# Altium schematic sheet single-phase_bridge_over.SchDoc
size A3
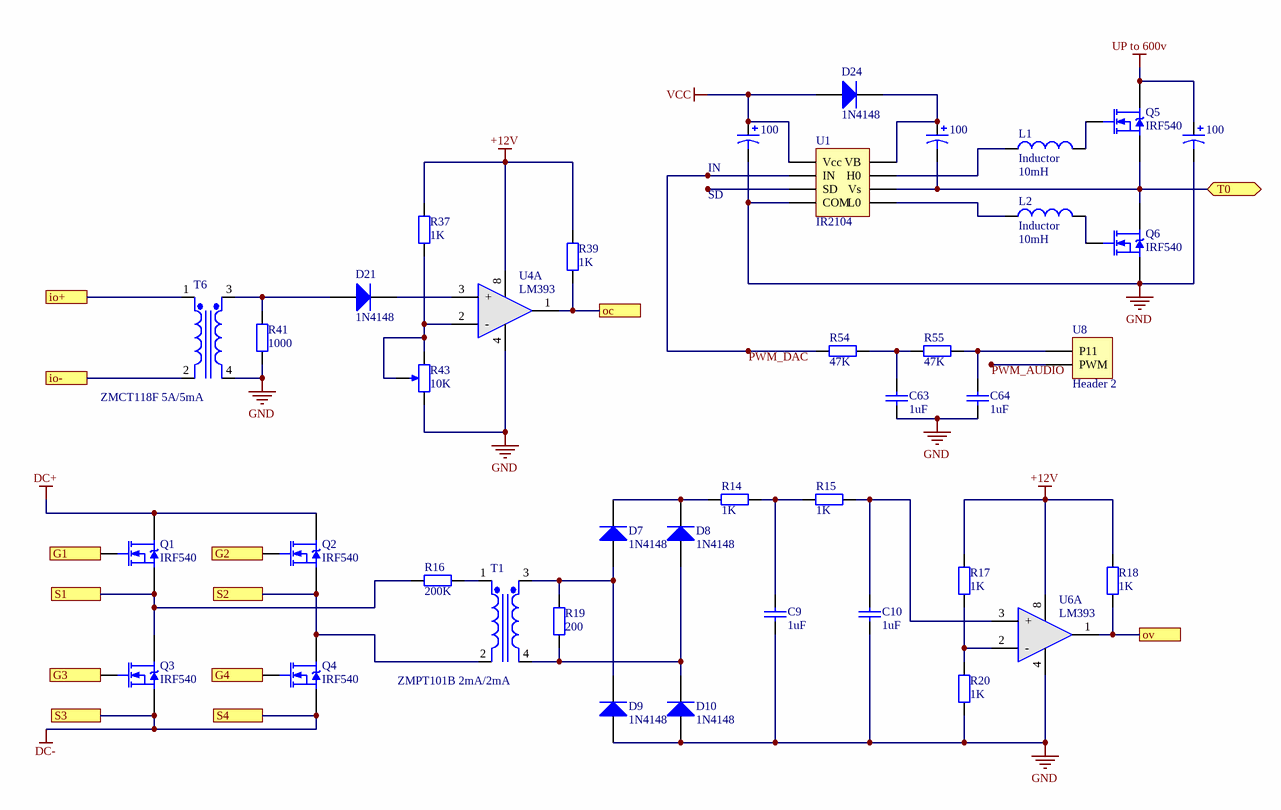
[diagram p0: single-phase_bridge_over.SchDoc]

## Parts
(Parts that share a designator on the sheet are numbered #1, #2 ... from top to bottom, then left to right.)
100#1  (no value)  [C0805]
100#2  (no value)  [C0805]
100#3  (no value)  [C0805]
C9  value 1uF  [0805C]  (hidden comment: Cap)
C10  value 1uF  [0805C]  (hidden comment: Cap)
C63  value 1uF  [0805C]  (hidden comment: Cap)
C64  value 1uF  [0805C]  (hidden comment: Cap)
D7  Type: 1N4148  [DIODE-SMA]  (hidden comment: Diode)
D8  Type: 1N4148  [DIODE-SMA]  (hidden comment: Diode)
D9  Type: 1N4148  [DIODE-SMA]  (hidden comment: Diode)
D10  Type: 1N4148  [DIODE-SMA]  (hidden comment: Diode)
D21  Type: 1N4148  [DIODE-SMA]  (hidden comment: Diode)
D24  Type: 1N4148  [DIODE-SMA]  (hidden comment: Diode)
L1  Inductor  value 10mH  [0402-A]
L2  Inductor  value 10mH  [0402-A]
Q1  IRF540  [TO-220]
Q2  IRF540  [TO-220]
Q3  IRF540  [TO-220]
Q4  IRF540  [TO-220]
Q5  IRF540  [TO-220]
Q6  IRF540  [TO-220]
R14  value 1K  [0805R]  (hidden comment: Res2)
R15  value 1K  [0805R]  (hidden comment: Res2)
R16  value 200K  [0805R]  (hidden comment: Res2)
R17  1K  [0805R]
R18  1K  [0805R]
R19  value 200  [0805R]  (hidden comment: Res2)
R20  1K  [0805R]
R37  1K  [0805R]
R39  1K  [0805R]
R41  value 1000  [0805R]  (hidden comment: Res2)
R43  10K  [RPot_3296W]
R54  value 47K  [0805R]  (hidden comment: Res2)
R55  value 47K  [0805R]  (hidden comment: Res2)
T1  ZMPT101B 2mA/2mA  [PT ZMPT101B]
T6  ZMCT118F 5A/5mA  [PT ZMPT101B]
U1  IR2104  [HDR2X4H]
U4  LM393  [DIP8]  (part A of 2)
U6  LM393  [DIP8]  (part A of 2)
U8  Header 2  [HDR1X2]

## Ports
G1, G2, G3, G4, io+, io-, oc, ov, S1, S2, S3, S4, T0

## Nets
+12V: R17.2 R18.2 R37.2 R39.2 U4.8(V-) U6.8(V-)
DC+: Q1.2(D) Q2.2(D)
DC-: Q3.3(S) Q4.3(S) ; port S3, port S4
GND: 100#1.2 100#3.2 C9.1 C10.1 C63.1 C64.1 D9.1(A) D10.1(A) Q6.3(S) R20.1 R41.1 R43.1(TOP) T6.4(Sec-) U1.7(COM) U4.4(V+) U6.4(V+)
UP to 600v: 100#3.1 Q5.2(D)
VCC: 100#1.1 D24.1(A) U1.1(Vcc)
G1: Q1.1(G) ; port G1
G2: Q2.1(G) ; port G2
G3: Q3.1(G) ; port G3
G4: Q4.1(G) ; port G4
io+: T6.1(Pri+) ; port io+
io-: T6.2(Pri-) ; port io-
oc: R39.1 U4.1(OUT) ; port oc
ov: R18.1 U6.1(OUT) ; port ov
S1: Q1.3(S) Q3.2(D) R16.1 ; port S1
S2: Q2.3(S) Q4.2(D) T1.2(Pri-) ; port S2
T0: 100#2.2 Q5.3(S) Q6.2(D) U1.6(Vs) ; port T0
Net100#2_1: 100#2.1 D24.2(K) U1.2(VB)
NetC9_2: C9.2 R14.1 R15.2
NetC10_2: C10.2 R15.1 U6.3(+)
NetC63_2: C63.2 R54.1 R55.2
NetC64_2: C64.2 R55.1 U8.1(P11)
NetD7_1: D7.1(A) D9.2(K) R19.2 T1.3(Sec+)
NetD7_2: D7.2(K) D8.2(K) R14.2
NetD8_1: D8.1(A) D10.2(K) R19.1 T1.4(Sec-)
NetD21_1: D21.1(A) R41.2 T6.3(Sec+)
NetD21_2: D21.2(K) U4.3(+)
NetL1_1: L1.1 U1.4(H0)
NetL1_2: L1.2 Q5.1(G)
NetL2_1: L2.1 U1.8(L0)
NetL2_2: L2.2 Q6.1(G)
NetR16_2: R16.2 T1.1(Pri+)
NetR17_1: R17.1 R20.2 U6.2(-)
NetR37_1: R37.1 R43.2(TAP) R43.3(BOT) U4.2(-)
NetR54_2: R54.2 U1.3(IN)

Not connected (* = marked no-connect by the designer): U1 5(SD); U8 2(PWM)

## Notes on the sheet
- (near 100#1) IN
- (near 100#1) SD
- Labels drawn without touching a wire or pin: PWM_AUDIO, PWM_DAC

## Library data of the parts
100#1-100#3 = Cap Pol3: Polarized Capacitor (Surface Mount); Published: 8-Jun-2000; LatestRevisionDate: 29-May-2009; LatestRevisionNote: IPC-7351 Footprint Added.; PackageReference: C0805; Publisher: Altium Limited; PackageDescription: Chip Capacitor
C9 C10 C63 C64 = Cap: 无极性电容; Published: 8-Jun-2000; LatestRevisionDate: 17-Jul-2002; LatestRevisionNote: Re-released for DXP Platform.; PackageReference: RAD-0.3; Publisher: Altium Limited
D7-D10 D21 D24 = Diode: 二极管; Published: 8-Jun-2000; LatestRevisionDate: 17-Jul-2002; LatestRevisionNote: Re-released for DXP Platform.; PackageDocument: Sep-1996; PackageReference: SMC; Publisher: Altium Limited; Code_JEDEC: DO-214-AB
L1 L2 = Inductor: Code_IEC: 1005; Published: 8-Jun-2000; LatestRevisionDate: 29-May-2009; LatestRevisionNote: IPC-7351 Footprint Added.; PackageReference: 0402-A; Publisher: Altium Limited; PackageDescription: Chip Inductor; Code_JEITA: 0402
Q1-Q6 = MOSFET-N: N-Channel MOSFET; PackageDocument: 1995/1996; Published: 8-Jun-2000; LatestRevisionDate: 17-Jul-2002; LatestRevisionNote: Re-released for DXP Platform.; PackageReference: E3; Publisher: Altium Limited
R14-R16 R19 R41 R54 R55 = Res2: Resistor; Published: 8-Jun-2000; LatestRevisionDate: 17-Jul-2002; LatestRevisionNote: Re-released for DXP Platform.; PackageReference: AXIAL-0.4; Publisher: Altium Limited
R17 R18 R20 R37 R39 = Res: 电阻; Published: 8-Jun-2000; LatestRevisionDate: 17-Jul-2002; LatestRevisionNote: Re-released for DXP Platform.; PackageReference: AXIAL-0.4; Publisher: Altium Limited
R43 = RPot: 电位器; Sim Note: Enter the Resistance value and the set point into parameter fields.; Set Position: 0.5; Published: 8-Jun-2000; LatestRevisionDate: 17-Jul-2002; LatestRevisionNote: Re-released for DXP Platform.; PackageReference: VR5; Publisher: Altium Limited
T1 T6 = DL-PT202H1
U1 = Header 4X2H: Header, 4-Pin, Dual row, Right Angle; LatestRevisionDate: 17-Jul-2002; LatestRevisionNote: Re-released for DXP Platform.; Publisher: Altium Limited
U4 U6 = LM393: 2比较器芯片
U8 = Header 2: Header, 2-Pin; LatestRevisionDate: 17-Jul-2002; LatestRevisionNote: Re-released for DXP Platform.; Publisher: Altium Limited